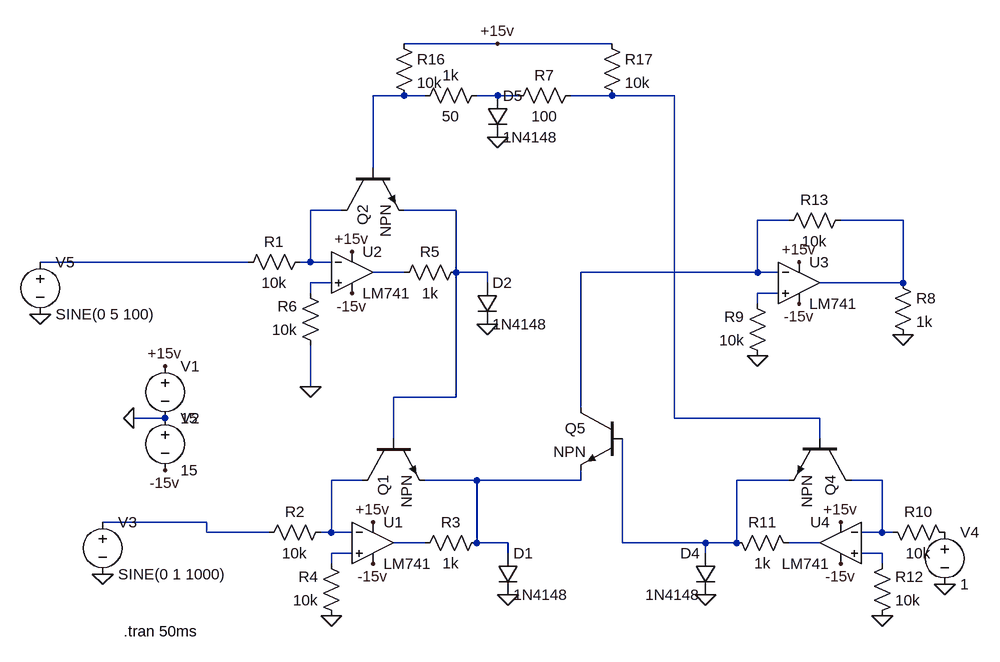
[diagram p0: schematic Mulipier_(opsitive_sides_only).asc]
Mulipier_(opsitive_sides_only).asc, the LTspice schematic file:
Version 4
SHEET 1 880 680
WIRE 80 -608 -64 -608
WIRE 256 -608 80 -608
WIRE -64 -528 -112 -528
WIRE -32 -528 -64 -528
WIRE 80 -528 48 -528
WIRE 112 -528 80 -528
WIRE 256 -528 192 -528
WIRE 352 -528 256 -528
WIRE -112 -416 -112 -528
WIRE -160 -352 -208 -352
WIRE 16 -352 -64 -352
WIRE 528 -336 480 -336
WIRE 704 -336 608 -336
WIRE -304 -272 -624 -272
WIRE -208 -272 -208 -352
WIRE -208 -272 -224 -272
WIRE -176 -272 -208 -272
WIRE -64 -256 -112 -256
WIRE 16 -256 16 -352
WIRE 64 -256 16 -256
WIRE 480 -256 480 -336
WIRE 480 -256 208 -256
WIRE 512 -256 480 -256
WIRE -176 -240 -208 -240
WIRE 64 -240 64 -256
WIRE 704 -240 704 -336
WIRE 704 -240 576 -240
WIRE -208 -224 -208 -240
WIRE 512 -224 480 -224
WIRE 480 -208 480 -224
WIRE -208 -80 -208 -144
WIRE 16 -64 16 -256
WIRE 16 -64 -80 -64
WIRE 208 -48 208 -256
WIRE -432 -32 -480 -32
WIRE 352 -32 352 -528
WIRE 576 -32 352 -32
WIRE -80 0 -80 -64
WIRE 576 0 576 -32
WIRE -128 64 -176 64
WIRE 48 64 -32 64
WIRE 208 64 208 48
WIRE 208 64 48 64
WIRE 528 64 448 64
WIRE 672 64 624 64
WIRE -368 128 -528 128
WIRE -368 144 -368 128
WIRE -272 144 -368 144
WIRE -176 144 -176 64
WIRE -176 144 -192 144
WIRE -144 144 -176 144
WIRE 672 144 672 64
WIRE 672 144 640 144
WIRE 688 144 672 144
WIRE -32 160 -80 160
WIRE 48 160 48 64
WIRE 96 160 48 160
WIRE 272 160 272 0
WIRE 400 160 272 160
WIRE 448 160 448 64
WIRE 448 160 400 160
WIRE 576 160 528 160
WIRE -144 176 -176 176
WIRE 96 176 96 160
WIRE 400 176 400 160
WIRE 672 176 640 176
WIRE -176 192 -176 176
WIRE 672 192 672 176
FLAG 96 240 0
FLAG -176 272 0
FLAG -480 -32 0
FLAG -432 -112 +15v
FLAG -432 48 -15v
FLAG -112 192 -15v
FLAG -112 128 +15v
FLAG -528 208 0
FLAG 64 -176 0
FLAG -144 -224 -15v
FLAG -144 -288 +15v
FLAG 480 -128 0
FLAG 544 -208 -15v
FLAG 544 -272 +15v
FLAG 400 240 0
FLAG 672 272 0
FLAG 608 192 -15v
FLAG 608 128 +15v
FLAG 80 -608 +15v
FLAG 80 -464 0
FLAG 768 224 0
FLAG -624 -192 0
FLAG -208 -80 0
FLAG 704 -160 0
SYMBOL res -288 160 R270
WINDOW 0 32 56 VTop 2
WINDOW 3 0 56 VBottom 2
SYMATTR InstName R2
SYMATTR Value 10k
SYMBOL res -48 176 R270
WINDOW 0 32 56 VTop 2
WINDOW 3 0 56 VBottom 2
SYMATTR InstName R3
SYMATTR Value 1k
SYMBOL diode 80 176 R0
SYMATTR InstName D1
SYMATTR Value 1N4148
SYMBOL npn -128 0 M90
SYMATTR InstName Q1
SYMBOL res -160 288 R180
WINDOW 0 36 76 Left 2
WINDOW 3 36 40 Left 2
SYMATTR InstName R4
SYMATTR Value 10k
SYMBOL voltage -432 -128 R0
WINDOW 123 0 0 Left 0
WINDOW 39 0 0 Left 0
SYMATTR InstName V1
SYMATTR Value 15
SYMBOL voltage -432 -48 R0
WINDOW 123 0 0 Left 0
WINDOW 39 0 0 Left 0
SYMATTR InstName V2
SYMATTR Value 15
SYMBOL voltage -528 112 R0
WINDOW 123 0 0 Left 0
WINDOW 39 0 0 Left 0
SYMATTR InstName V3
SYMATTR Value SINE(0 1 1000)
SYMBOL LM741 -144 -320 R0
SYMATTR InstName U2
SYMBOL res -320 -256 R270
WINDOW 0 32 56 VTop 2
WINDOW 3 0 56 VBottom 2
SYMATTR InstName R1
SYMATTR Value 10k
SYMBOL res -80 -240 R270
WINDOW 0 32 56 VTop 2
WINDOW 3 0 56 VBottom 2
SYMATTR InstName R5
SYMATTR Value 1k
SYMBOL diode 48 -240 R0
SYMATTR InstName D2
SYMATTR Value 1N4148
SYMBOL npn -160 -416 M90
SYMATTR InstName Q2
SYMBOL res -192 -128 R180
WINDOW 0 36 76 Left 2
WINDOW 3 36 40 Left 2
SYMATTR InstName R6
SYMATTR Value 10k
SYMBOL LM741 544 -304 R0
SYMATTR InstName U3
SYMBOL res 496 -112 R180
WINDOW 0 36 76 Left 2
WINDOW 3 36 40 Left 2
SYMATTR InstName R9
SYMATTR Value 10k
SYMBOL LM741 608 96 M0
SYMATTR InstName U4
SYMBOL res 784 160 M270
WINDOW 0 32 56 VTop 2
WINDOW 3 0 56 VBottom 2
SYMATTR InstName R10
SYMATTR Value 10k
SYMBOL res 544 176 M270
WINDOW 0 32 56 VTop 2
WINDOW 3 0 56 VBottom 2
SYMATTR InstName R11
SYMATTR Value 1k
SYMBOL diode 416 176 M0
SYMATTR InstName D4
SYMATTR Value 1N4148
SYMBOL npn 624 0 R90
SYMATTR InstName Q4
SYMBOL res 656 288 M180
WINDOW 0 36 76 Left 2
WINDOW 3 36 40 Left 2
SYMATTR InstName R12
SYMATTR Value 10k
SYMBOL npn 272 -48 M0
SYMATTR InstName Q5
SYMBOL res 624 -352 R90
WINDOW 0 0 56 VBottom 2
WINDOW 3 32 56 VTop 2
SYMATTR InstName R13
SYMATTR Value 10k
SYMBOL res 64 -544 R90
WINDOW 0 0 56 VBottom 2
WINDOW 3 32 56 VTop 2
SYMATTR InstName 1k
SYMATTR Value 50
SYMBOL res -80 -624 R0
SYMATTR InstName R16
SYMATTR Value 10k
SYMBOL res 240 -624 R0
SYMATTR InstName R17
SYMATTR Value 10k
SYMBOL diode 64 -528 R0
SYMATTR InstName D5
SYMATTR Value 1N4148
SYMBOL voltage 768 128 R0
WINDOW 123 0 0 Left 0
WINDOW 39 0 0 Left 0
SYMATTR InstName V4
SYMATTR Value 1
SYMBOL voltage -624 -288 R0
WINDOW 123 0 0 Left 0
WINDOW 39 0 0 Left 0
SYMATTR InstName V5
SYMATTR Value SINE(0 5 100)
SYMBOL res 208 -544 R90
WINDOW 0 0 56 VBottom 2
WINDOW 3 32 56 VTop 2
SYMATTR InstName R7
SYMATTR Value 100
SYMBOL LM741 -112 96 R0
SYMATTR InstName U1
SYMBOL res 688 -256 R0
SYMATTR InstName R8
SYMATTR Value 1k
TEXT -496 296 Left 2 !.tran 50ms

The netlist it stands for:
* Mulipier_(opsitive_sides_only).asc
R2 N016 N012 10k
R3 N017 N013 1k
D1 N013 0 1N4148
Q1 N012 N005 N013 0 NPN
R4 0 N019 10k
V1 +15v 0 15
V2 0 -15v 15
V3 N016 0 SINE(0 1 1000)
XU2 N010 N004 +15v -15v N009 LM741  ; pins In+ In- V+ V- OUT
R1 N008 N004 10k
R5 N009 N005 1k
D2 N005 0 1N4148
Q2 N004 N001 N005 0 NPN
R6 0 N010 10k
XU3 N011 N006 +15v -15v N007 LM741  ; pins In+ In- V+ V- OUT
R9 0 N011 10k
XU4 N020 N015 +15v -15v N018 LM741  ; pins In+ In- V+ V- OUT
R10 P001 N015 10k
R11 N018 N014 1k
D4 N014 0 1N4148
Q4 N015 N003 N014 0 NPN
R12 0 N020 10k
Q5 N006 N014 N013 0 NPN
R13 N007 N006 10k
R§1k N002 N001 50
R16 +15v N001 10k
R17 +15v N003 10k
D5 N002 0 1N4148
V4 P001 0 1
V5 N008 0 SINE(0 5 100)
R7 N003 N002 100
XU1 N019 N012 +15v -15v N017 LM741  ; pins In+ In- V+ V- OUT
R8 N007 0 1k
.model D D
.lib standard.dio
.model NPN NPN
.model PNP PNP
.lib standard.bjt
.tran 50ms
.lib LM741.lib
.backanno
.end